# Altium schematic sheet USB-C.SchDoc
size A3; SheetNumber: 3; SheetTotal: 6; SPICEModelCacheSZWREHAK: <root> / <DocumentId>SZWREHAK</DocumentId> / <CacheFrame Number="0"> / <Model Name="cap" Kind="MDL"> / <Text>*Default semiconductor capacitor / .MODEL CAP C()</Text> / </Model> / <Model Name="led2" Kind="MDL"> / <Text>*Typ RED,GREEN,YELLOW,AMBER GaAs LED: Vf=2.1V Vr=4V If=40mA trr=3uS / *LED Pinout: 1=A, 2=K / .MODEL LED2 D (IS=93.1P RS=42M N=4.61 BV=4 IBV=10U / + CJO=2.97P VJ=.75 M=.333 TT=4.32U)</Text> / </Model> / </CacheFrame> / </root>
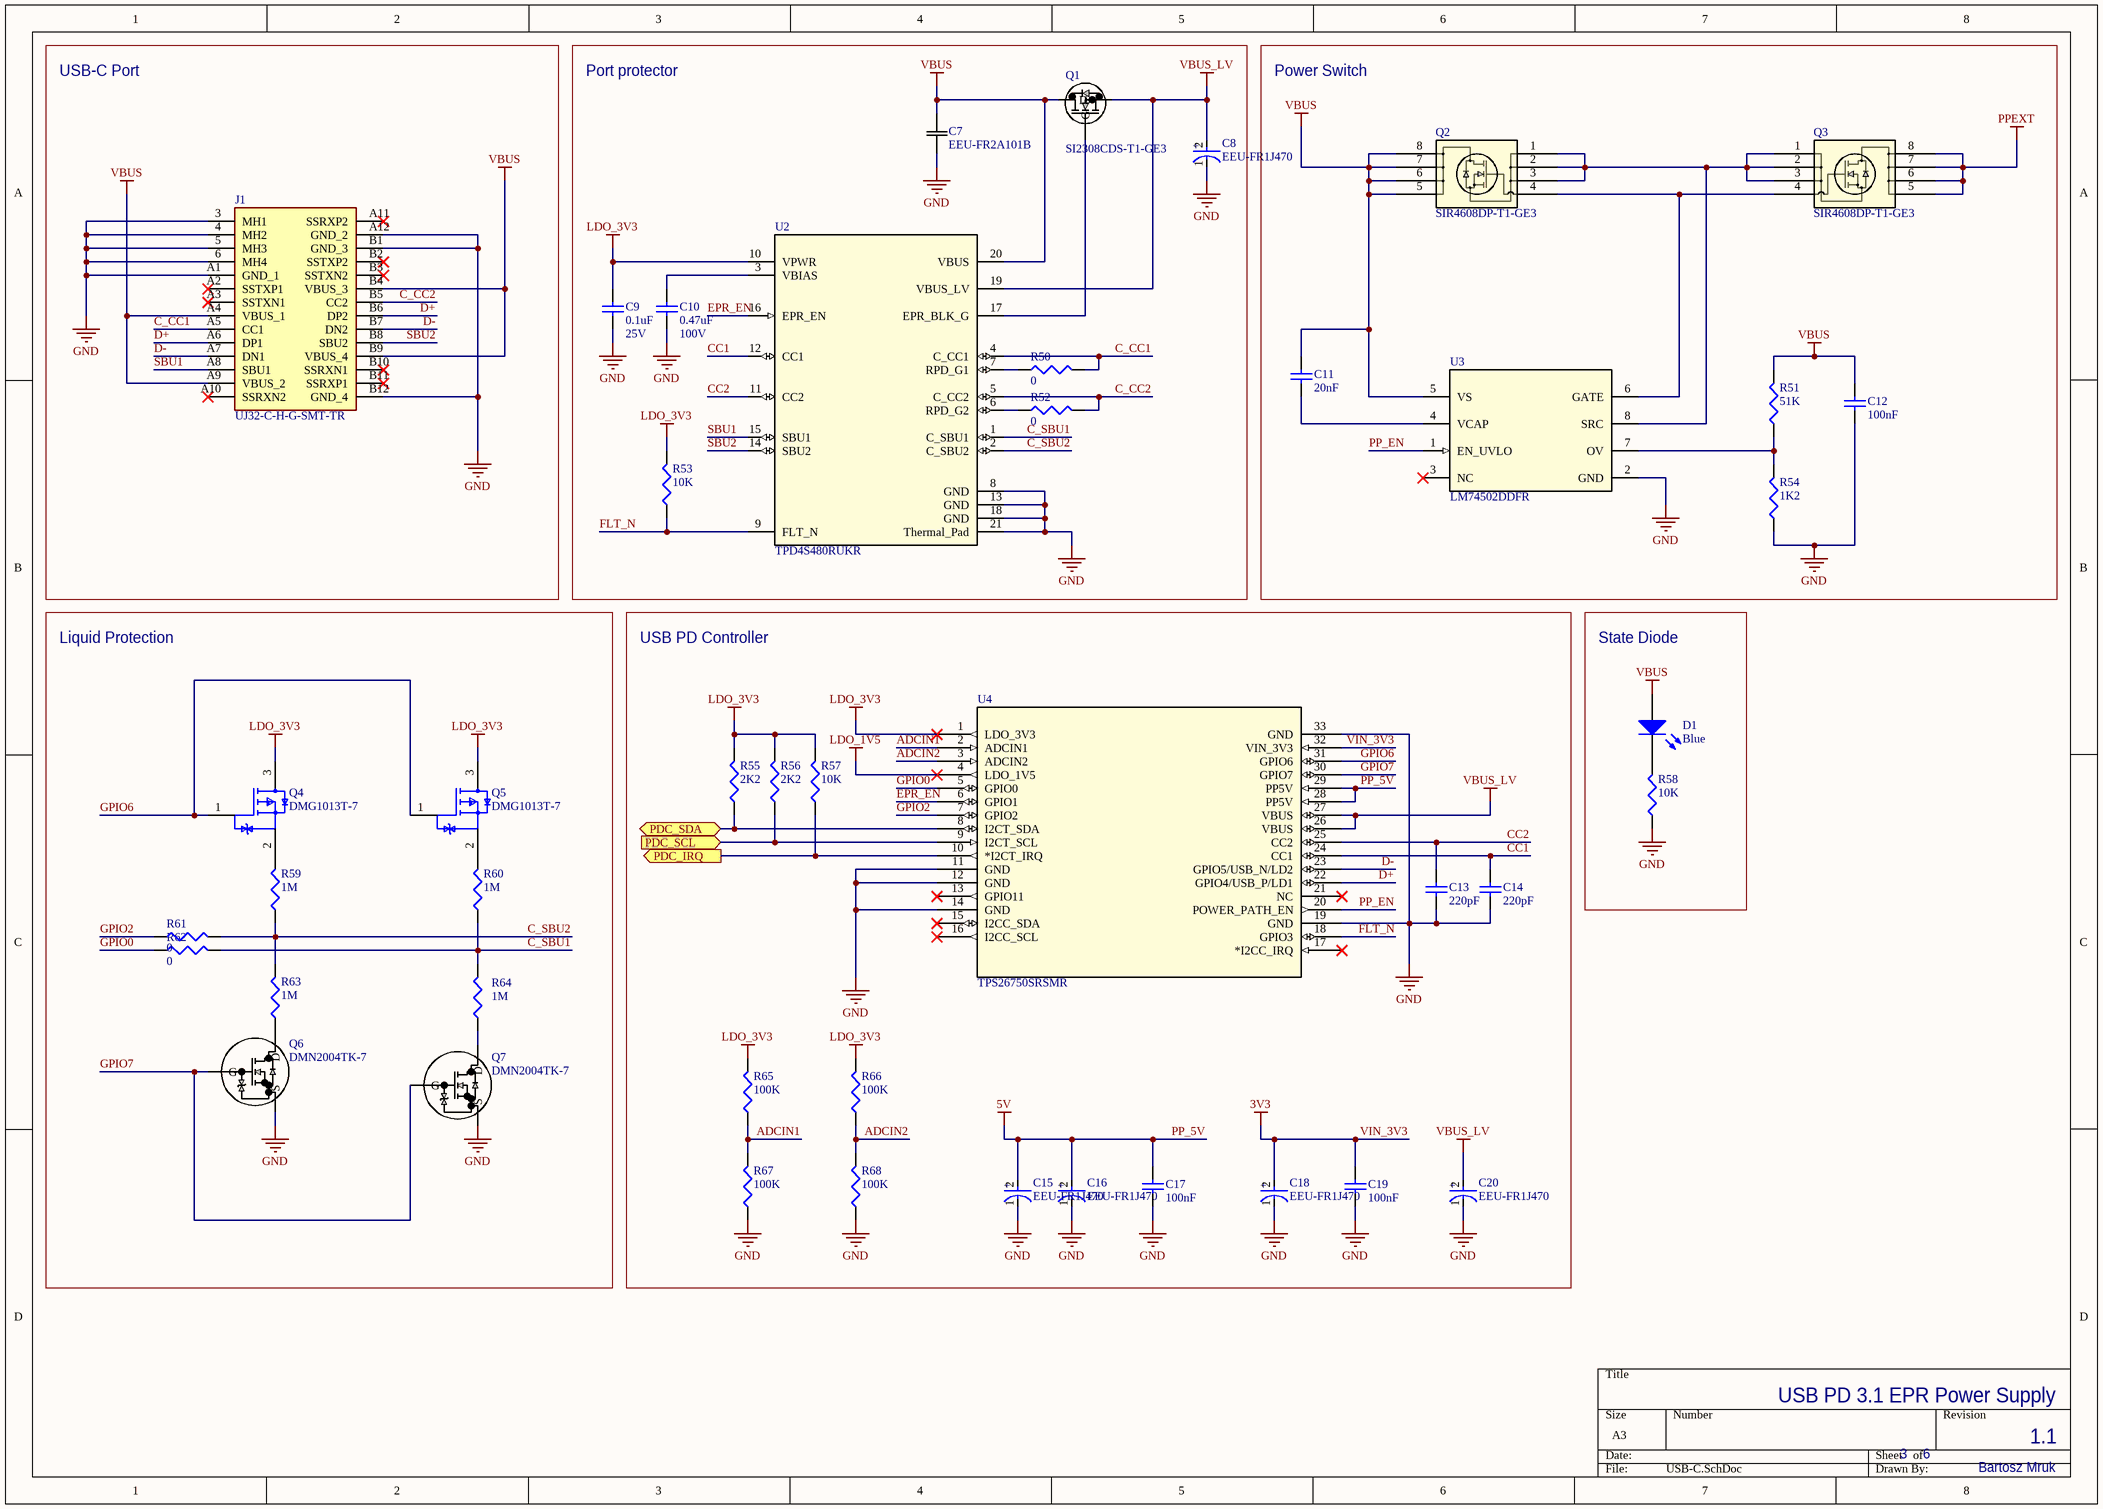
[diagram p0: USB-C.SchDoc]

## Parts
C7  EEU-FR2A101B  [CAP_EEU-FR2A101B_PAN]
C8  EEU-FR1J470  [FP-EEU-FR1J470-MFG]
C9  25V  value 0.1uF  [C1206]
C10  100V  value 0.47uF  [C1206]
C11  value 20nF  [C1206]  (hidden comment: at least 13V)
C12  value 100nF  [C1206]  (hidden comment: Cap Semi)
C13  value 220pF  [0402]  (hidden comment: Cap Semi)
C14  value 220pF  [0402]  (hidden comment: Cap Semi)
C15  EEU-FR1J470  [FP-EEU-FR1J470-MFG]
C16  EEU-FR1J470  [FP-EEU-FR1J470-MFG]
C17  value 100nF  [C1206]  (hidden comment: Cap Semi)
C18  EEU-FR1J470  [FP-EEU-FR1J470-MFG]
C19  value 100nF  [C1206]  (hidden comment: Cap Semi)
C20  EEU-FR1J470  [FP-EEU-FR1J470-MFG]
D1  Blue  [3.2X1.6X1.1]
J1  UJ32-C-H-G-SMT-TR  [UJ32CHGSMTTR]
Q1  SI2308CDS-T1-GE3  [SOT-23_TO-236_VIS]
Q2  SIR4608DP-T1-GE3  [POWERPAK_SO-8_SINGLE_VIS]
Q3  SIR4608DP-T1-GE3  [POWERPAK_SO-8_SINGLE_VIS]
Q4  DMG1013T-7  [FP-SOT523-IPC_A]
Q5  DMG1013T-7  [FP-SOT523-IPC_A]
Q6  DMN2004TK-7  [SOT523_DMN2004_DIO]
Q7  DMN2004TK-7  [SOT523_DMN2004_DIO]
R50  value 0  [J1-0603]  (hidden comment: Res3)
R51  value 51K  [J1-0603]  (hidden comment: Res3)
R52  value 0  [J1-0603]  (hidden comment: Res3)
R53  value 10K  [J1-0603]  (hidden comment: Res3)
R54  value 1K2  [J1-0603]  (hidden comment: Res3)
R55  value 2K2  [J1-0603]  (hidden comment: Res3)
R56  value 2K2  [J1-0603]  (hidden comment: Res3)
R57  value 10K  [J1-0603]  (hidden comment: Res3)
R58  value 10K  [J1-0603]  (hidden comment: Res3)
R59  value 1M  [J1-0603]  (hidden comment: Res3)
R60  value 1M  [J1-0603]  (hidden comment: Res3)
R61  value 0  [J1-0603]  (hidden comment: Res3)
R62  value 0  [J1-0603]  (hidden comment: Res3)
R63  value 1M  [J1-0603]  (hidden comment: Res3)
R64  value 1M  [J1-0603]  (hidden comment: Res3)
R65  value 100K  [J1-0603]  (hidden comment: Res3)
R66  value 100K  [J1-0603]  (hidden comment: Res3)
R67  value 100K  [J1-0603]  (hidden comment: Res3)
R68  value 100K  [J1-0603]  (hidden comment: Res3)
U2  TPD4S480RUKR  [RUK0020B-IPC_A]
U3  LM74502DDFR  [DDF0008A-IPC_A]
U4  TPS26750SRSMR  [VQFN32_RSM_TEX]

## Blocks framed on the sheet
USB-C Port: J1
Port protector: C7-C10 Q1 R50 R52 R53 U2
Power Switch: C11 C12 Q2 Q3 R51 R54 U3
Liquid Protection: Q4-Q7 R59-R64
USB PD Controller: C13-C20 R55-R57 R65-R68 U4
State Diode: D1 R58

## Ports
PDC_IRQ (out), PDC_SCL (in), PDC_SDA (bidir)

## Nets
GND: C7.2 C8.1(C) C9.1 C10.1 C12.1 C13.1 C14.1 C15.1(C) C16.1(C) C17.1 C18.1(C) C19.1 C20.1(C) J1.3(MH1) J1.4(MH2) J1.5(MH3) J1.6(MH4) J1.A1(GND_1) J1.A12(GND_2) J1.B1(GND_3) J1.B12(GND_4) Q6.3(S) Q7.3(S) R54.1 R58.1 R67.1 R68.1 U2.8(GND) U2.13(GND) U2.18(GND) U2.21(Thermal_Pad) U3.2(GND) U4.11(GND) U4.12(GND) U4.14(GND) U4.19(GND) U4.33(GND)
LDO_1V5: U4.4(LDO_1V5)
LDO_3V3: C9.2 Q4.3(D) Q5.3(D) R53.2 R55.2 R56.2 R57.2 R65.2 R66.2 U2.10(VPWR) U4.1(LDO_3V3)
PP_5V: C15.2(A) C16.2(A) C17.2 U4.28(PP5V) U4.29(PP5V)  [also labelled 5V]
PPEXT: Q3.5 Q3.6 Q3.7 Q3.8
VBUS: C7.1 C11.2 C12.2 D1.1(A) J1.A4(VBUS_1) J1.A9(VBUS_2) J1.B4(VBUS_3) J1.B9(VBUS_4) Q1.2(D) Q2.5 Q2.6 Q2.7 Q2.8 R51.2 U2.20(VBUS) U3.5(VS)
VBUS_LV: C8.2(A) C20.2(A) Q1.3(S) U2.19(VBUS_LV) U4.26(VBUS) U4.27(VBUS)
VIN_3V3: C18.2(A) C19.2 U4.32(VIN_3V3)  [also labelled 3V3]
ADCIN1: R65.1 R67.2 U4.2(ADCIN1)
ADCIN2: R66.1 R68.2 U4.3(ADCIN2)
C_CC1: J1.A5(CC1) R50.2 U2.4(C_CC1)
C_CC2: J1.B5(CC2) R52.2 U2.5(C_CC2)
C_SBU1: R60.1 R62.2 R64.2 U2.1(C_SBU1)
C_SBU2: R59.1 R61.2 R63.2 U2.2(C_SBU2)
CC1: C14.2 U2.12(CC1) U4.24(CC1)
CC2: C13.2 U2.11(CC2) U4.25(CC2)
D+: J1.A6(DP1) J1.B6(DP2) U4.22(GPIO4/USB_P/LD1)
D-: J1.A7(DN1) J1.B7(DN2) U4.23(GPIO5/USB_N/LD2)
EPR_EN: U2.16(EPR_EN) U4.6(GPIO1)
FLT_N: R53.1 U2.9(FLT_N) U4.18(GPIO3)
GPIO0: R62.1 U4.5(GPIO0)
GPIO2: R61.1 U4.7(GPIO2)
GPIO6: Q4.1(G) Q5.1(G) U4.31(GPIO6)
GPIO7: Q6.1(G) Q7.1(G) U4.30(GPIO7)
PDC_IRQ: R57.1 U4.10(*I2CT_IRQ) ; port PDC_IRQ
PDC_SCL: R56.1 U4.9(I2CT_SCL) ; port PDC_SCL
PDC_SDA: R55.1 U4.8(I2CT_SDA) ; port PDC_SDA
PP_EN: U3.1(EN_UVLO) U4.20(POWER_PATH_EN)
SBU1: J1.A8(SBU1) U2.15(SBU1)
SBU2: J1.B8(SBU2) U2.14(SBU2)
NetC10_2: C10.2 U2.3(VBIAS)
NetC11_1: C11.1 U3.4(VCAP)
NetD1_2: D1.2(K) R58.2
NetQ1_1: Q1.1(G) U2.17(EPR_BLK_G)
NetQ2_1: Q2.1 Q2.2 Q2.3 Q3.1 Q3.2 Q3.3 U3.8(SRC)
NetQ2_4: Q2.4 Q3.4 U3.6(GATE)
NetQ4_2: Q4.2(S) R59.2
NetQ5_2: Q5.2(S) R60.2
NetQ6_2: Q6.2(D) R63.1
NetQ7_2: Q7.2(D) R64.1
NetR50_1: R50.1 U2.7(RPD_G1)
NetR51_1: R51.1 R54.2 U3.7(OV)
NetR52_1: R52.1 U2.6(RPD_G2)

Not connected (* = marked no-connect by the designer): J1 A2(SSTXP1)* A3(SSTXN1)* A10(SSRXN2)* A11(SSRXP2)* B2(SSTXP2)* B3(SSTXN2)* B10(SSRXN1)* B11(SSRXP1)*; U3 3(NC)*; U4 13(GPIO11)* 15(I2CC_SDA)* 16(I2CC_SCL)* 17(*I2CC_IRQ)* 21(NC)*

## Notes on the sheet
- 3
- 6
- 1.1
- USB PD 3.1 EPR Power Supply
- Bartosz Mruk
- (in symbol CMP-05427-000066-1) +

## Library data of the parts
C7 = EEU-FR2A101B: No Description Available; Manufacturer_Name: Panasonic; Copyright: Copyright (C) 2025 Ultra Librarian. All rights reserved.; Manufacturer_Part_Number: EEU-FR2A101B
C8 C15 C16 C18 C20 = CMP-05427-000066-1: CAP ALUM 47UF 20% 63V RADIAL; ESR (Equivalent Series Resistance): 210mR; Lead Diameter: 0.5mm; Life (Hours): 5000Hour; Ripple Current (AC): 284mA; Height - Seated (Max): 0.5inch; Radiation Hardening: No; Termination: Radial; Contact Plating: Tin; Length: 11.2mm; Tolerance: 20%; Voltage: 63V; Max Operating Temperature: 105°C; Construction: Cylindrical; Lead Free: Lead Free; Series: FR; Mount: Through Hole; Lead Pitch: 2.5mm; Capacitance: 47uF; Case/Package: Radial; Voltage Rating (DC): 63V; Diameter: 6.3mm; Impedance: 210mR; RoHS Compliant: Yes; Height: 11.2mm; REACH SVHC: No SVHC; Package Quantity: 200; Ripple Current: 284mA; Voltage Rating: 63V; Packaging: Bulk; Min Operating Temperature: -40°C
C9-C14 C17 C19 = Cap Semi: Capacitor (Semiconductor SIM Model); Published: 8-Jun-2000; LatestRevisionDate: 29-May-2009; LatestRevisionNote: IPC-7351 Footprint Added.; PackageReference: C1206; Publisher: Altium Limited; PackageDescription: Chip Capacitor
D1 = LED2: Typical RED, GREEN, YELLOW, AMBER GaAs LED; Published: 8-Jun-2000; LatestRevisionDate: 17-Jul-2002; LatestRevisionNote: Re-released for DXP Platform.; PackageVersion: Feb-2002; PackageReference: 3.2X1.6X1.1; Publisher: Altium Limited; PackageDescription: SM LED; 2 Flat Leads
J1 = UJ32-C-H-G-SMT-TR: UJ32-C-H-G-SMT-TR - Type C, USB 3.2 Gen 2x2, 20 Gbps, 20 Vac, 5 A, Right Angle, Gold Flash, Surface Mount, Black Insulator, USB Receptacle; Manufacturer_Name: Same Sky; Geometry.Height: 3.71mm; Mouser Part Number: 179-UJ32CHGSMTTR; Mouser Price/Stock: https://www.mouser.co.uk/ProductDetail/CUI-Devices/UJ32-C-H-G-SMT-TR?qs=vvQtp7zwQdNJg60%252BwYKIHw%3D%3D; Manufacturer_Part_Number: UJ32-C-H-G-SMT-TR; Datasheet Link: https://www.sameskydevices.com/product/resource/UJ32-C-H-G-SMT-TR.pdf
Q1 = SI2308CDS-T1-GE3: N-CHANNEL 60-V (D-S) MOSFET; Manufacturer_Name: Vishay; Copyright: Copyright (C) 2025 Ultra Librarian. All rights reserved.; Manufacturer_Part_Number: SI2308CDS-T1-GE3
Q2 Q3 = SIR4608DP-T1-GE3: N-CHANNEL 60-V (D-S) MOSFET; Manufacturer_Name: Vishay; Copyright: Copyright (C) 2025 Ultra Librarian. All rights reserved.; Manufacturer_Part_Number: SIR4608DP-T1-GE3; RefDes: RefDes; Type: Type
Q4 Q5 = CMP-12801-000011-2: MOSFET P-CH 20V 0.46A SOT-523; Threshold Voltage: -1V; Continuous Drain Current (ID): 460mA; Rise Time: 8.1ns; Turn-Off Delay Time: 28.4ns; Number of Channels: 1; On-State Resistance: 700mR; Power Dissipation: 270mW; Input Capacitance: 59.76pF; Fall Time: 20.7ns; Turn-On Delay Time: 5.1ns; Drain to Source Resistance: 1R; Drain to Source Breakdown Voltage: -20V; Gate to Source Voltage (Vgs): 6V; Element Configuration: Single; Min Operating Temperature: -55°C; Max Operating Temperature: 150°C; Case/Package: SOT-523; Lead Free: Lead Free; Length: 1.7mm; REACH SVHC: No SVHC; Radiation Hardening: No; Number of Pins: 3; Weight: 7.1E-05oz; Rds On Max: 700mR; Height: 0.8mm; Number of Elements: 1; Packaging: Tape and Reel; Mount: Surface Mount; Width: 0.85mm; Drain to Source Voltage (Vdss): 20V; Max Power Dissipation: 270mW; Contact Plating: Tin; Package Quantity: 1
Q6 Q7 = DMN2004TK-7: Description; Manufacturer_Name: Diodes Inc; Copyright: Copyright (C) 2025 Ultra Librarian. All rights reserved.; Manufacturer_Part_Number: DMN2004TK-7
R50-R68 = Res3: Resistor; Published: 8-Jun-2000; LatestRevisionDate: 29-May-2009; LatestRevisionNote: IPC-7351 Footprint Added.; PackageReference: J1-0603; Publisher: Altium Limited; PackageDescription: Chip Resistor
U2 = TPD4S480RUKR: USB Type-Câ„¢ 48V EPR port protector with short-to-VBUS overvoltage and IEC ESD protection 20-WQFN -40 to 125; Manufacturer_Name: Texas Instruments; TYPE: TYPE; RefDes: RefDes; Copyright: Copyright (C) 2025 Ultra Librarian. All rights reserved.; Manufacturer_Part_Number: TPD4S480RUKR
U3 = LM74502DDFR: 3.2-V to 65-V industrial RPP controller with load disconnect and OVP 8-SOT-23-THIN -40 to 125; Manufacturer_Name: Texas Instruments; TYPE: TYPE; RefDes: RefDes; Copyright: Copyright (C) 2025 Ultra Librarian. All rights reserved.; Manufacturer_Part_Number: LM74502DDFR
U4 = TPS26750SRSMR: USB Type-CÂ® and USB Power Delivery (PD) 3.1 controller with 240-W extended power range support  32-VQFN -40 to 125; Manufacturer_Name: Texas Instruments; Copyright: Copyright (C) 2025 Ultra Librarian. All rights reserved.; Manufacturer_Part_Number: TPS26750SRSMR; RefDes: RefDes; Type: Type